# EasyEDA Pro project ProPrj_OPA4377运放改良.epro

# Schematic Schematic1
Create Date: 2023-03-22; Page Name: P1; Project Name: OPA4377运放2.0; Schematic Name: Schematic1; Update Date: 2023-03-23; Company: 嘉立创EDA; Page Size: A4; Version: V1.0
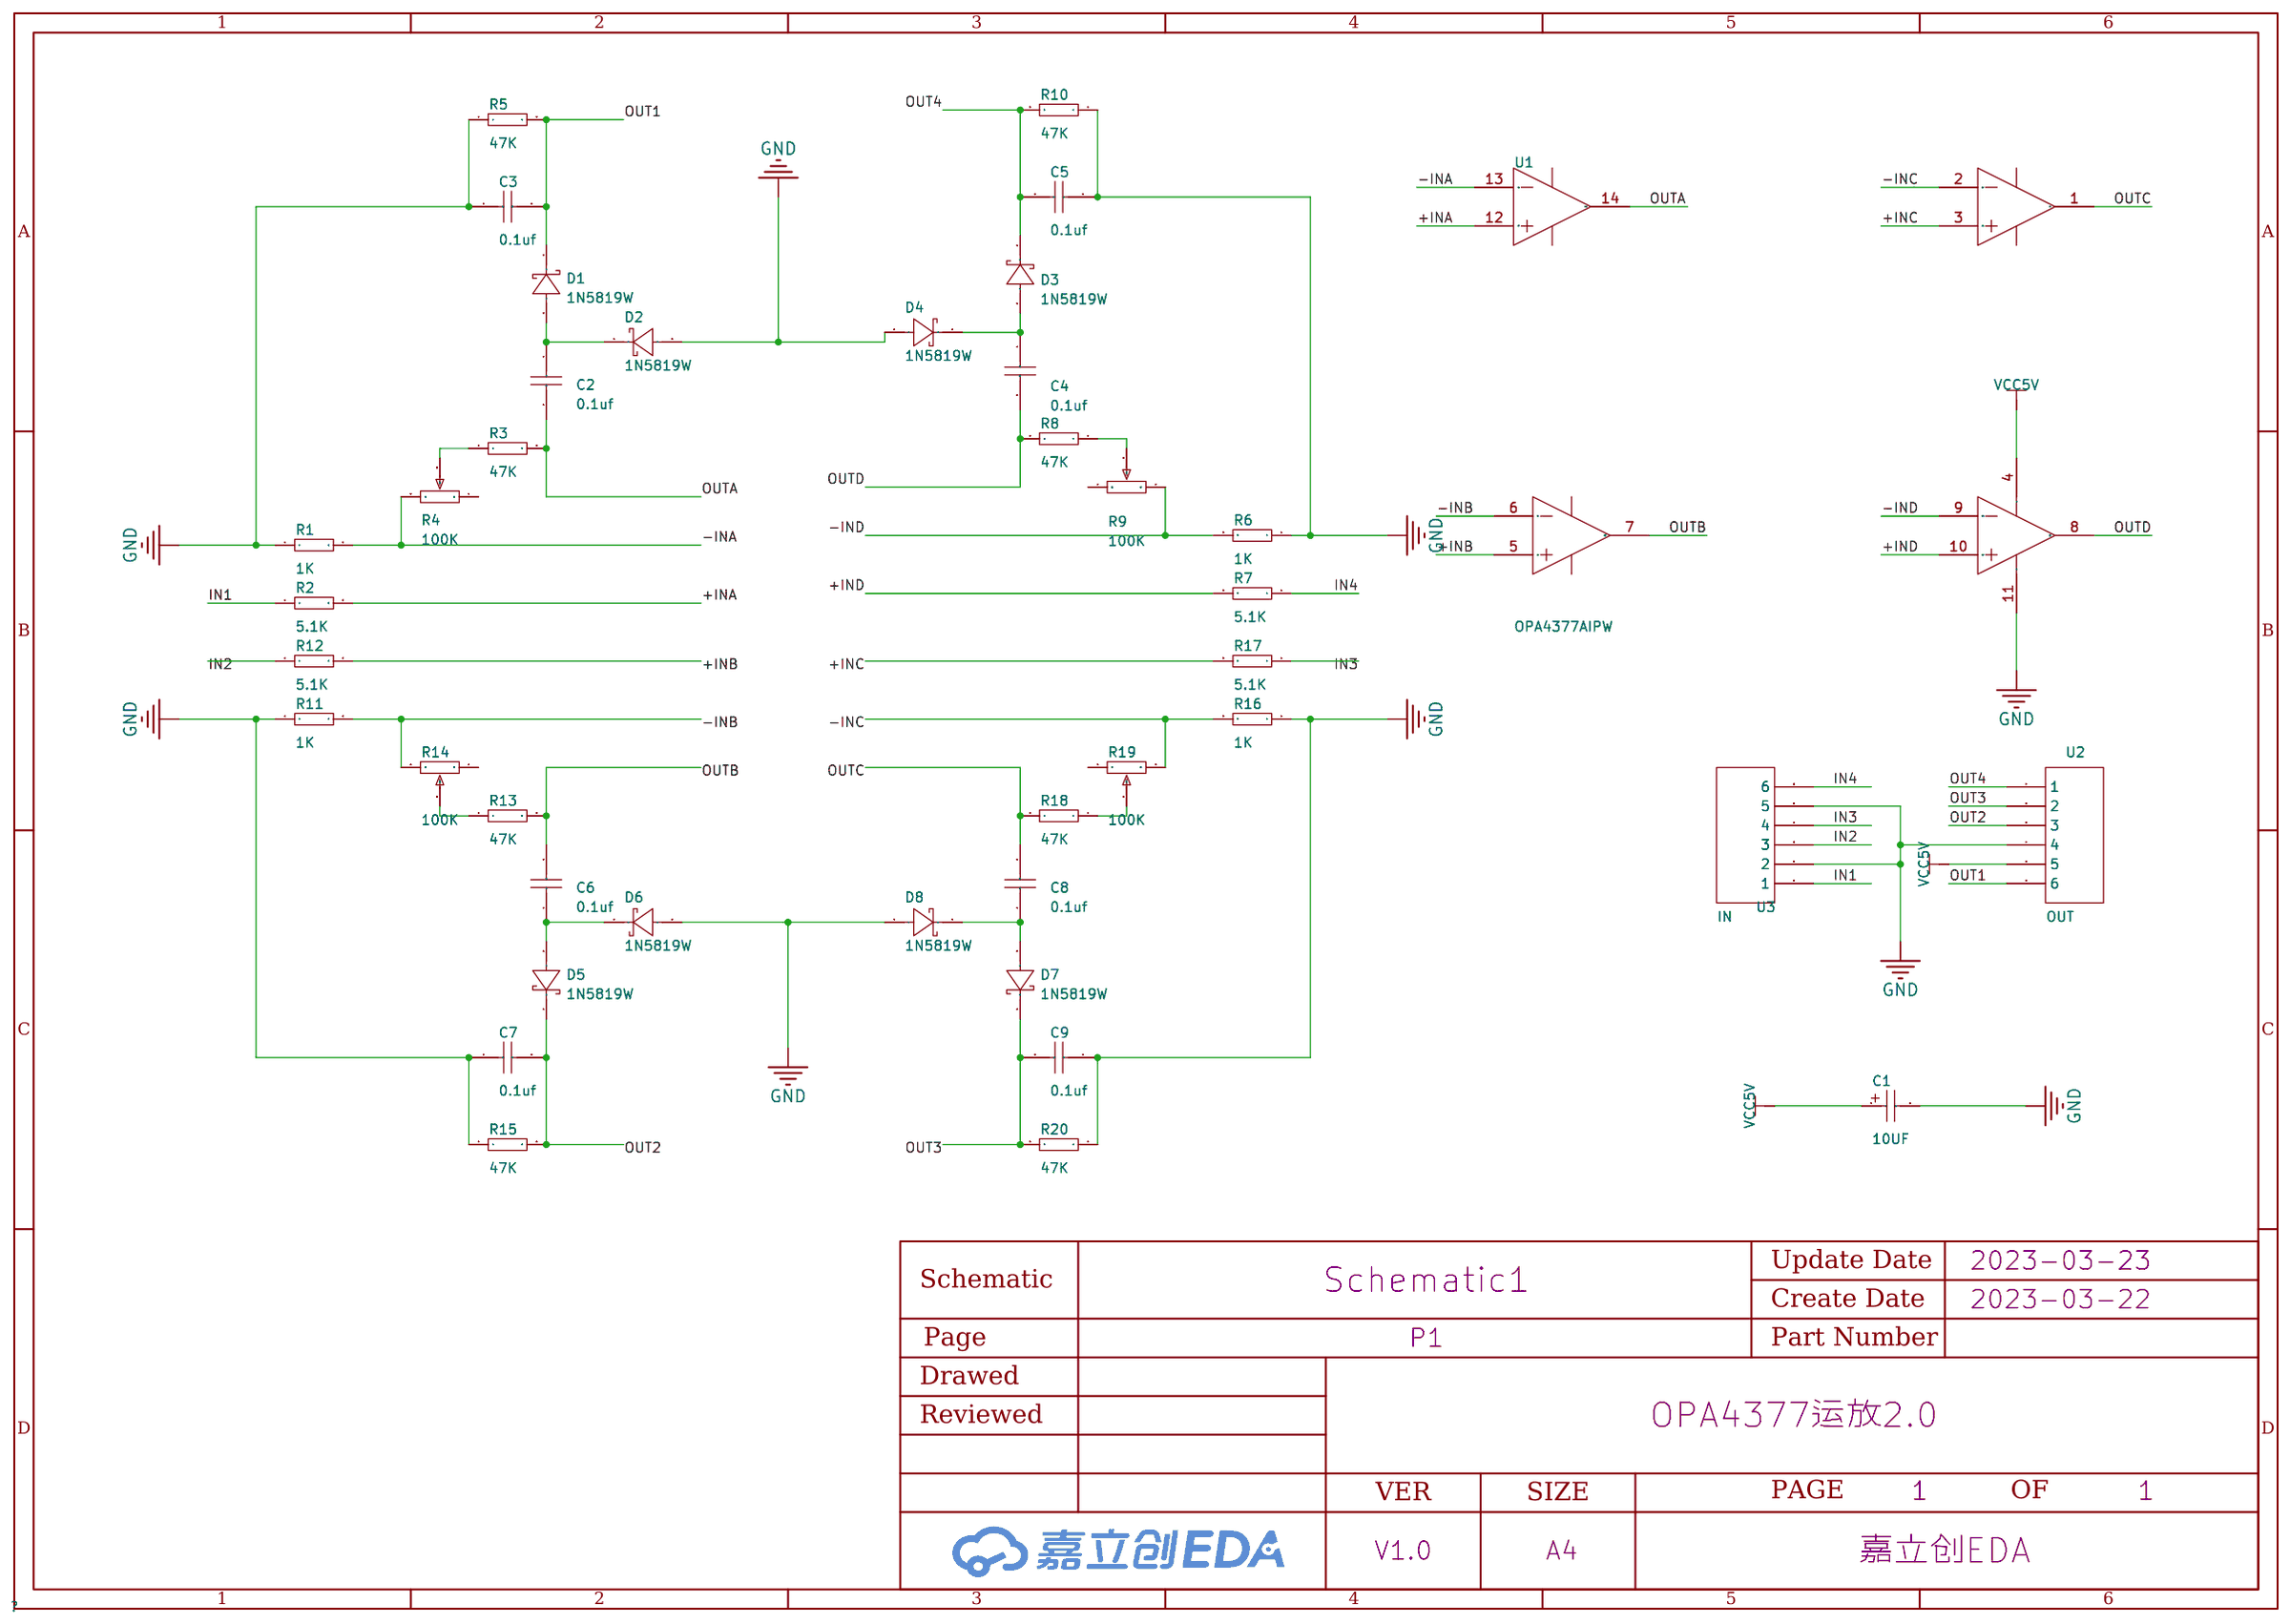
[diagram p0: schematic sheet]

## Parts
C1  10UF  [CASE-A_3216]
C2  1uF  [CAPC1608[0603]S-N]
C3  1uF  [CAPC1608[0603]S-N]
C4  1uF  [CAPC1608[0603]S-N]
C5  1uF  [CAPC1608[0603]S-N]
C6  1uF  [CAPC1608[0603]S-N]
C7  1uF  [CAPC1608[0603]S-N]
C8  1uF  [CAPC1608[0603]S-N]
C9  1uF  [CAPC1608[0603]S-N]
D1  1N5819W  [SOD-123_L2.7-W1.6-LS3.7-RD-1]
D2  1N5819W  [SOD-123_L2.7-W1.6-LS3.7-RD-1]
D3  1N5819W  [SOD-123_L2.7-W1.6-LS3.7-RD-1]
D4  1N5819W  [SOD-123_L2.7-W1.6-LS3.7-RD-1]
D5  1N5819W  [SOD-123_L2.7-W1.6-LS3.7-RD-1]
D6  1N5819W  [SOD-123_L2.7-W1.6-LS3.7-RD-1]
D7  1N5819W  [SOD-123_L2.7-W1.6-LS3.7-RD-1]
D8  1N5819W  [SOD-123_L2.7-W1.6-LS3.7-RD-1]
R1  10R  [RESC1608[0603]S-N]
R2  10R  [RESC1608[0603]S-N]
R3  10R  [RESC1608[0603]S-N]
R4  100K  [RESPOT3296]
R5  10R  [RESC1608[0603]S-N]
R6  10R  [RESC1608[0603]S-N]
R7  10R  [RESC1608[0603]S-N]
R8  10R  [RESC1608[0603]S-N]
R9  100K  [RESPOT3296]
R10  10R  [RESC1608[0603]S-N]
R11  10R  [RESC1608[0603]S-N]
R12  10R  [RESC1608[0603]S-N]
R13  10R  [RESC1608[0603]S-N]
R14  100K  [RESPOT3296]
R15  10R  [RESC1608[0603]S-N]
R16  10R  [RESC1608[0603]S-N]
R17  10R  [RESC1608[0603]S-N]
R18  10R  [RESC1608[0603]S-N]
R19  100K  [RESPOT3296]
R20  10R  [RESC1608[0603]S-N]
U1  OPA4377AIPW  [TSSOP-14_L5.0-W4.4-P0.65-LS6.4-BL]
U2  OUT  [HDR1X6]
U3  IN  [HDR1X6]

## Library data of the parts
C1 = TAJA105K035RNJ: 容值:1uF;精度:±10%;额定电压:35V;等效串联电阻:7.5Ω@100kHz;工作温度:-55℃~+125℃;; LCSC Part Name: 1uF±10%35V; Supplier Part: C7176; Manufacturer: KyoceraAVX; Supplier Footprint: CASE-A-3216; JLCPCB Part Class: ExtendedPart; Datasheet: https://atta.szlcsc.com/upload/public/pdf/source/20160107/1457707748301.pdf; Supplier: LCSC; Tolerance: ±10%; Rated Voltage: 35V; Equivalent Series Resistance(ESR): 7.5Ω@100kHz; Operating Temperature: -55℃~+125℃
C2-C9 = Cap-Chip_1: Published: 2020-12-18; Revision: V1.1; Voltage: 50V; Tolerance: ±10%; Origin Footprint 2: CAPC1310[0504]S; Origin Footprint 3: CAPC3216[1206]S; Origin Footprint 4: CAPC3225[1210]S; Origin Footprint 5: CAPC4532[1812]S; Origin Footprint 6: CAPC4564[1825]S; Origin Footprint 7: CAPC2012[0805]; Origin Footprint 8: CAPC3216[1206]; Origin Footprint 9: CAPC3225[1210]; Origin Footprint 10: CAPC4532[1812]; Origin Footprint 11: CAPC4564[1825]; Origin Footprint 12: CAPC1608[0603]-N; Origin Footprint 13: CAPC1608[0603]-L; Origin Footprint 14: CAPC1608[0603]-M; Origin Footprint 15: CAPC1608[0603]S-L; Origin Footprint 16: CAPC1608[0603]S-M; Origin Footprint 17: CAPC1005[0402]-L; Origin Footprint 18: CAPC1005[0402]-M; Origin Footprint 19: CAPC1005[0402]-N; Origin Footprint 20: CAPC1005[0402]S-L; Origin Footprint 21: CAPC1005[0402]S-M; Origin Footprint 22: CAPC1005[0402]S-N; Origin Footprint 23: CAPC2012[0805]S-L; Origin Footprint 24: CAPC2012[0805]S-M; Origin Footprint 25: CAPC2012[0805]S-N
D1-D8 = 1N5819W: 二极管配置:-;直流反向耐压(Vr):40V;平均整流电流(Io):1A;正向压降(Vf):900mV@3A;反向电流(Ir):1mA@40V;; LCSC Part Name: 40V1A900mV@3A; Supplier Part: C2905650; Manufacturer: TECHPUBLIC(台舟); Supplier Footprint: SOD-123; JLCPCB Part Class: ExtendedPart; Datasheet: https://atta.szlcsc.com/upload/public/pdf/source/20211020/7FEA34DA99E5285CBA3CC87767B82BE7.pdf; Supplier: LCSC; Reverse Voltage (Vr): 40V; Average Rectified Current (Io): 1A; Forward Voltage (Vf@If): 900mV@3A; Reverse Leakage Current (Ir): 1mA@40V
R1-R3 R5-R8 R10-R13 R15-R18 R20 = Res-Chip_9: Published: 8-Jun-2000; Revision: July-2002:Re-releasedforDXPPlatform.; Tolerance: ±1%; Origin Footprint 2: RESC3225[1210]S; Origin Footprint 3: RESC5025[2010]S; Origin Footprint 4: RESC6332[2512]S; Origin Footprint 5: RESC5025[2010]; Origin Footprint 6: RESC6332[2512]; Origin Footprint 7: RESC3225[1210]; Origin Footprint 8: RESC3216[1206]; Origin Footprint 9: RESC2012[0805]; Origin Footprint 10: RESC1608[0603]-M; Origin Footprint 11: RESC1608[0603]-L; Origin Footprint 12: RESC1608[0603]-N; Origin Footprint 13: RESC1608[0603]S-L; Origin Footprint 14: RESC1608[0603]S-M; Origin Footprint 15: RESC1005[0402]-L; Origin Footprint 16: RESC1005[0402]-N; Origin Footprint 17: RESC1005[0402]-M; Origin Footprint 18: RESC1005[0402]S-L; Origin Footprint 19: RESC1005[0402]S-M; Origin Footprint 20: RESC1005[0402]S-N; Origin Footprint 21: RESC2012[0805]S-L; Origin Footprint 22: RESC2012[0805]S-M; Origin Footprint 23: RESC2012[0805]S-N; Origin Footprint 24: RESC3216[1206]S-L; Origin Footprint 25: RESC3216[1206]S-M; Origin Footprint 26: RESC3216[1206]S-N
R4 R9 R14 R19 = Res Adj 3p: Origin Footprint 2: RESPOTSMALL
U1 = OPA4377AIPW: 四路低成本、低噪声、5.5MHz CMOS 运算放大器 14-TSSOP -40 to 125; Supplier Part: C1346362; Manufacturer: TI(德州仪器); Supplier Footprint: TSSOP-14; JLCPCB Part Class: ExtendedPart; Datasheet: https://atta.szlcsc.com/upload/public/pdf/source/20230221/EF1F22C2868CA7F32EC9D4A7EBFD265F.pdf; Supplier: LCSC
U2 U3 = Header 6: LatestRevisionDate: 17-Jul-2002; LatestRevisionNote: Re-releasedforDXPPlatform.; Publisher: AltiumLimited; Price(RMB): 0.00; Origin Footprint 2: PH2.0-6; Origin Footprint 3: XH2.54-6; Origin Footprint 4: VH3.96-6; Origin Footprint 5: GH1.25T-6P; Origin Footprint 6: ZH1.5-WF-6P

## Nets
GND: C1.2 C3.1 C5.1 C7.1 C9.1 D2.2(A) D4.2(A) D6.2(A) D8.2(A) R1.1 R5.1 R6.1 R10.1 R11.1 R15.1 R16.1 R20.1 U1.11(V-) U2.4 U3.2 U3.5
VCC5V: C1.1 U1.4(V+) U2.5
+INA: R2.2 U1.12(IN D+)
+INB: R12.2 U1.5(IN B+)
+INC: R17.2 U1.3(IN A+)
+IND: R7.2 U1.10(IN C+)
-INA: R1.2 R4.2(BOT) U1.13(IN D-)
-INB: R11.2 R14.2(BOT) U1.6(IN B-)
-INC: R16.2 R19.2(BOT) U1.2(IN A-)
-IND: R6.2 R9.2(BOT) U1.9(IN C-)
IN1: R2.1 U3.1
IN2: R12.1 U3.3
IN3: R17.1 U3.4
IN4: R7.1 U3.6
OUT1: C3.2 D1.1(K) R5.2 U2.6
OUT2: C7.2 D5.1(K) R15.2 U2.3
OUT3: C9.2 D7.1(K) R20.2 U2.2
OUT4: C5.2 D3.1(K) R10.2 U2.1
OUTA: C2.2 R3.2 U1.14(OUT D)
OUTB: C6.2 R13.2 U1.7(OUT B)
OUTC: C8.2 R18.2 U1.1(OUT A)
OUTD: C4.2 R8.2 U1.8(OUT C)
$1N1144: R3.1 R4.ADJ
$1N1300: C2.1 D1.2(A) D2.1(K)
$1N3786: R8.1 R9.ADJ
$1N3789: C4.1 D3.2(A) D4.1(K)
$1N4182: R13.1 R14.ADJ
$1N4185: C6.1 D5.2(A) D6.1(K)
$1N4578: R18.1 R19.ADJ
$1N4581: C8.1 D7.2(A) D8.1(K)

Not connected (* = marked no-connect by the designer): R4 1(TOP); R9 1(TOP); R14 1(TOP); R19 1(TOP)

# Board PCB1
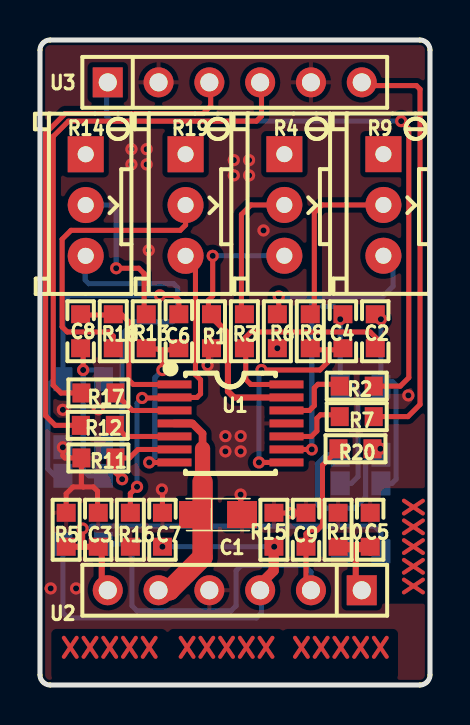
[diagram p1: board, top side]
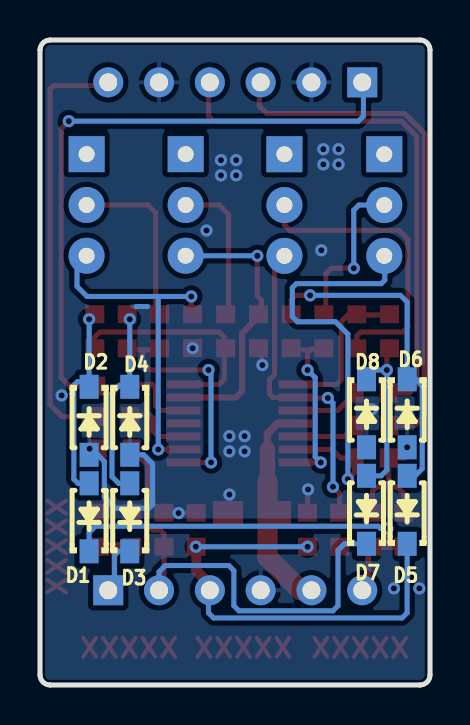
[diagram p2: board, bottom side, seen from below]

Outline 19.5 x 32.26 mm; copper layers: Top Layer, Bottom Layer. Coordinates in mm from the lower left corner of the outline.
Outline path: 0,31.75 0,0.51 arc(0.15,0.15) 0.51,0 18.99,0 arc(19.35,0.15) 19.5,0.51 19.5,31.75 arc(19.35,32.11) 18.99,32.26 0.51,32.26 arc(0.15,32.11) 0,31.75
Stack: Top Layer 0.035mm / Dielectric1 1.51mm FR4 er 4.5 / Bottom Layer 0.035mm

## Design rules (mm)
template: 自定义配置
spacing copperThickness1oz (default): track to track 0.102, other pairs 0.152 to 0.3
spacing copperThickness2oz: track to track 0.203, other pairs 0.152 to 0.3
track width copperThickness1oz (default): min 0.127, default 0.254, max 2.54
track width copperThickness2oz: min 0.203, default 0.254, max 2.54
differential pair differentialPair (default): width min 0.127, default 0.254, max 2.54; gap min 0.152, default 0.152
via viaSize (default): diameter min 0.5, default 0.61, max 10; hole min 0.3, default 0.305, max 6.3

## Placement (name value [footprint] x y rotation side)
C1  10UF  [CASE-A_3216]  8.9 8.52 0 top
C2  1uF  [CAPC1608[0603]S-N]  16.76 17.69 270 top
C3  1uF  [CAPC1608[0603]S-N]  2.91 7.76 270 top
C4  1uF  [CAPC1608[0603]S-N]  15.15 17.69 270 top
C5  1uF  [CAPC1608[0603]S-N]  16.51 7.76 270 top
C6  1uF  [CAPC1608[0603]S-N]  6.94 17.69 270 top
C7  1uF  [CAPC1608[0603]S-N]  6.12 7.76 270 top
C8  1uF  [CAPC1608[0603]S-N]  2.03 17.69 90 top
C9  1uF  [CAPC1608[0603]S-N]  13.3 7.76 270 top
D1  1N5819W  [SOD-123_L2.7-W1.6-LS3.7-RD-1]  17.04 8.39 90 bottom
D2  1N5819W  [SOD-123_L2.7-W1.6-LS3.7-RD-1]  17.04 13.21 270 bottom
D3  1N5819W  [SOD-123_L2.7-W1.6-LS3.7-RD-1]  15.01 8.39 90 bottom
D4  1N5819W  [SOD-123_L2.7-W1.6-LS3.7-RD-1]  15.01 13.21 270 bottom
D5  1N5819W  [SOD-123_L2.7-W1.6-LS3.7-RD-1]  1.14 8.76 90 bottom
D6  1N5819W  [SOD-123_L2.7-W1.6-LS3.7-RD-1]  1.14 13.59 270 bottom
D7  1N5819W  [SOD-123_L2.7-W1.6-LS3.7-RD-1]  3.17 8.76 90 bottom
D8  1N5819W  [SOD-123_L2.7-W1.6-LS3.7-RD-1]  3.17 13.59 270 bottom
R1  10R  [RESC1608[0603]S-N]  8.57 17.69 90 top
R2  10R  [RESC1608[0603]S-N]  15.84 14.95 180 top
R3  10R  [RESC1608[0603]S-N]  10.22 17.69 270 top
R4  100K  [RESPOT3296]  12.22 26.55 270 top
R5  10R  [RESC1608[0603]S-N]  1.31 7.76 270 top
R6  10R  [RESC1608[0603]S-N]  11.87 17.69 90 top
R7  10R  [RESC1608[0603]S-N]  15.84 13.42 180 top
R8  10R  [RESC1608[0603]S-N]  13.51 17.69 270 top
R9  100K  [RESPOT3296]  17.17 26.55 270 top
R10  10R  [RESC1608[0603]S-N]  14.9 7.76 270 top
R11  10R  [RESC1608[0603]S-N]  2.92 11.36 0 top
R12  10R  [RESC1608[0603]S-N]  2.89 12.99 0 top
R13  10R  [RESC1608[0603]S-N]  5.31 17.69 270 top
R14  100K  [RESPOT3296]  2.29 26.54 270 top
R15  10R  [RESC1608[0603]S-N]  11.7 7.76 270 top
R16  10R  [RESC1608[0603]S-N]  4.52 7.76 90 top
R17  10R  [RESC1608[0603]S-N]  2.92 14.6 0 top
R18  10R  [RESC1608[0603]S-N]  3.66 17.69 90 top
R19  100K  [RESPOT3296]  7.28 26.54 270 top
R20  10R  [RESC1608[0603]S-N]  15.77 11.82 180 top
U1  OPA4377AIPW  [TSSOP-14_L5.0-W4.4-P0.65-LS6.4-BL]  9.52 13.08 270 top
U2  OUT  [HDR1X6]  16.09 4.74 180 top
U3  IN  [HDR1X6]  3.39 30.14 0 top

## Footprints (pads in the part's own frame, mm; a bottom-side part is the same pattern mirrored in y, then rotated)
CAPC1608[0603]S-N
  rect 0.9x0.95 smd: 1(-0.85,0) 2(0.85,0)
CASE-A_3216
  rect 1.5x1.359 smd: 1(-1.2,0) 2(1.2,0)
HDR1X6
  rect 1.5x1.5 hole 0.9: 1(0,0)
  round 1.5 hole 0.9: 2(2.54,0) 3(5.08,0) 4(7.62,0) 5(10.16,0) 6(12.7,0)
RESC1608[0603]S-N
  rect 0.9x0.95 smd: 1(-0.85,0) 2(0.85,0)
RESPOT3296
  rect 1.8x1.8 hole 0.8: 1(0,0)
  round 1.8 hole 0.8: 2(5.08,0) ADJ(2.54,0)
SOD-123_L2.7-W1.6-LS3.7-RD-1
  rect 1.2x0.95 smd: 1(-1.7,0) 2(1.7,0)
TSSOP-14_L5.0-W4.4-P0.65-LS6.4-BL
  rect 0.4x1.7 smd: 1(-1.95,-2.8) 2(-1.3,-2.8) 3(-0.65,-2.8) 4(0,-2.8) 5(0.65,-2.8) 6(1.3,-2.8) 7(1.95,-2.8) 8(1.95,2.8) 9(1.3,2.8) 10(0.65,2.8) 11(0,2.8) 12(-0.65,2.8) 13(-1.3,2.8) 14(-1.95,2.8)

## Nets
As in the schematic.

Pads without a net: R4 1; R9 1; R14 1; R19 1

## Via types
v1: diameter 0.61, hole 0.305, Top Layer to Bottom Layer, 45 vias

## Routing (per net, layer and track width the routed paths; a pad name or vN(x,y) marks a point on that pad's centre or on a via; arc(x,y) is an arc through that point)
GND: length 20.8
  Top Layer w0.254: 2.88,8.61 2.88,9.7 2.67,9.91 2.16,9.91 ; C7.1 6.12,9.75 v1(6.1,9.78) ; R5.1 1.31,9.56 1.65,9.91 2.16,9.91 ; 13.3,8.6 v1(12.57,8.6) 11.68,8.6 ; 2.16,9.91 2.07,9.99 R11.1 1.25,11.36 1.14,11.46 v1(1.14,11.89) ; v1(8.38,16) 8.42,16.04 8.42,16.84 ; 10.03,8.43 v1(10.03,9.52)
  Bottom Layer w0.254: 14.12,18.93 14.69,18.93 ; D4.2 14.33,11.51 13.87,11.05 13.87,9.02 14.05,8.84 15.72,8.84 16.28,9.4 16.28,11.18 16.61,11.51 D2.2
  vias: v1(0.53,4.83) v1(1.14,13.76) v1(1.8,4.83) v1(2.92,13.79) v1(4.57,26.8) v1(4.57,26.03) v1(5.33,26.8) v1(5.33,26.03) v1(5.44,21.74) v1(9.27,12.45) v1(9.27,11.68) v1(9.69,26.25) v1(9.69,25.49) v1(10.03,12.45) v1(10.03,11.68) v1(10.45,26.25) v1(10.45,25.49) v1(11.18,22.73) v1(11.87,16.84) v1(17.02,11.82) v1(18.42,14.48)
VCC5V: length 10.7
  Top Layer w0.381: U1.4 7.62,13.08 8.13,12.57 8.13,11.81
  Top Layer w0.762: 8.13,11.81 8.13,10.16
  Top Layer w1.016: U2.5 6.47,4.74 8.13,6.39 8.13,10.16
+INA: length 3.8
  Top Layer w0.254: R2.2 14.89,15.04 13.9,15.04 13.72,14.86 13.72,13.97 13.48,13.73 U1.12
+INB: length 3.2
  Top Layer w0.254: 6.72,12.43 4.3,12.43 R12.2
+INC: length 3.3
  Top Layer w0.254: R17.2 3.77,14.58 4.62,13.73 U1.3
+IND: length 3.5
  Top Layer w0.254: R7.2 14.89,13.51 14.02,13.51 13.84,13.33 13.84,12.7 13.57,12.43 12.32,12.43
-INA: length 13.9
  Top Layer w0.254: 8.42,18.54 8.42,19.24 8.64,19.46 v1(8.64,21.46)
  Top Layer w0.305: 8.42,18.54 8.45,18.54 9.4,17.59 9.4,14.69 9.7,14.38 U1.13
  Bottom Layer w0.254: v1(8.64,21.46) 8.64,21.47 R4.2
-INB: length 22.2
  Top Layer w0.254: U1.6 4.9,11.78 4.47,11.36 R11.2 3.77,10.63 v1(4.11,10.29)
  Bottom Layer w0.254: R14.2 2.26,21.44 2.26,20.25 2.44,20.07 6.68,20.07 6.88,19.86 6.88,18.42 6.63,18.17 4.73,18.17 4.11,17.55 v1(4.11,10.29)
-INC: length 16.2
  Top Layer w0.254: v1(4.85,9.91) 4.52,9.58 R16.2 ; R19.2 7.77,20.97 7.77,15.52 8.03,15.27 8.03,14.56 7.85,14.38 U1.2 6.7,14.36 v1(5.11,14.36)
  Bottom Layer w0.254: v1(5.11,14.36) 4.85,14.1 v1(4.85,9.91)
-IND: length 17.6
  Top Layer w0.254: v1(11.94,19.43) 11.94,18.68 11.77,18.51 ; U1.9 v1(13.59,11.78)
  Bottom Layer w0.254: 13.59,19.43 v1(11.94,19.43) ; 13.59,19.43 17.14,19.43 17.65,19.94 17.65,20.99 R9.2 ; 13.59,19.43 v1(13.59,11.78)
IN1: length 31.5
  Top Layer w0.254: R2.1 18.02,14.95 18.44,15.37 18.44,27.82 v1(18.06,28.2)
  Bottom Layer w0.254: v1(18.06,28.2) 3.58,28.2 3.33,28.45 3.33,30.08 U3.1
IN2: length 26.2
  Top Layer w0.254: U3.3 8.54,30.07 8.54,28.96 8.15,28.58 1.27,28.58 0.28,27.59 0.28,13.47 0.76,12.99 R12.1 2.07,13.02 2.07,13.04
IN3: length 26.6
  Top Layer w0.254: R17.1 1.05,14.6 0.66,14.99 0.66,27.44 1.42,28.2 10.82,28.2 11.08,28.45 11.08,30.07 U3.4
IN4: length 21.4
  Top Layer w0.254: U3.6 16.25,29.98 18.82,29.98 19,29.8 19,14.03 18.4,13.42 R7.1
OUT1: length 20.8
  Top Layer w0.254: 2.16,6.91 2.13,6.94 v1(2.13,7.82)
  Top Layer w0.305: 2.88,6.91 R5.2 ; 2.88,6.91 3.09,6.7 3.09,4.74
  Bottom Layer w0.254: D1.1 17.04,7.62 16.73,7.94 2.58,7.94 2.47,7.82 v1(2.13,7.82)
OUT2: length 22.9
  Top Layer w0.508: 11.68,6.9 11.68,5.71 10.71,4.74
  Bottom Layer w0.254: v1(6.12,6.91) v1(11.71,6.91) ; D5.1 1.14,3.61 1.4,3.35 10.82,3.35 11.08,3.61 11.08,4.67 U2.3
OUT3: length 24.4
  Top Layer w0.254: 13.25,4.74 13.3,4.79 C9.2 13.3,7.56 13.49,7.75 13.87,7.75 14.12,8.01 14.12,10.99 14.66,11.53 14.66,11.55 R20.2
  Bottom Layer w0.254: D7.1 4.27,7.06 4.6,6.74 4.6,3.96 4.85,3.71 9.55,3.71 9.81,3.96 9.81,5.72 10.06,5.97 13.23,5.97 13.55,5.66 U2.2
OUT4: length 6.7
  Top Layer w0.305: 16.51,6.9 16.51,6.6 ; 15.81,6.9 15.79,6.88 15.79,4.74
  Top Layer w0.508: 14.95,6.9 16.51,6.9
  Bottom Layer w0.254: D3.1 15.57,6.69 15.77,6.48 15.77,5.05 U2.1
OUTA: length 11.7
  Top Layer w0.254: 16.76,16.8 16.89,16.8 16.89,17.27 16.51,17.65 10.54,17.65 10.29,17.4 10.29,15.28 10.54,15.03 12.32,15.03
OUTB: length 8.9
  Top Layer w0.254: 6.72,11.13 v1(5.46,11.13) ; v1(6.12,15.75) 6.12,16.61 5.97,16.76 ; 5.97,16.76 5.93,16.8 5.21,16.8 ; 5.97,16.76 6.82,16.76 6.86,16.8
  Bottom Layer w0.254: v1(6.12,15.75) 5.74,15.37 5.74,11.41 v1(5.46,11.13)
OUTC: length 7.9
  Top Layer w0.254: 6.72,15.03 4.66,15.03 4.44,15.25 4.44,18.16 4.06,18.54 3.59,18.54 3.56,18.5 2.03,18.5
OUTD: length 11.9
  Top Layer w0.254: 14.25,16.76 14.38,16.64 14.38,16.13 14,15.75 v1(11.08,15.75) ; 14.25,16.76 15.07,16.76 15.11,16.8 ; 14.25,16.76 13.5,16.76 13.46,16.8 ; 12.32,11.13 v1(10.95,11.13)
  Bottom Layer w0.254: v1(10.95,11.13) 10.95,15.63 v1(11.08,15.75)
$1N1144: length 7.3
  Top Layer w0.254: R4.ADJ 10.55,24.01 10.07,23.53 10.07,18.54
$1N1300: length 9.9
  Bottom Layer w0.254: v1(17.04,18.29) D2.1 17.3,15.17 17.63,15.17 17.81,14.99 17.81,10.29 17.6,10.09 D1.2
$1N3786: length 8.8
  Top Layer w0.254: 13.46,18.5 13.72,18.76 13.72,23.62 14.1,24.01 R9.ADJ
$1N3789: length 10
  Top Layer w0.254: v1(15.01,18.29) 15.15,18.43 C4.1
  Bottom Layer w0.254: v1(15.01,18.29) D4.1 15.09,14.99 15.52,14.99 15.9,14.61 15.9,10.42 15.57,10.09 D3.2
$1N4182: length 8.1
  Top Layer w0.254: v1(3.81,20.84) 4.94,20.84 5.21,20.57 5.21,18.65 R13.1
  Bottom Layer w0.254: v1(3.81,20.84) 3.81,23.75 3.56,24 2.29,24
$1N4185: length 16.5
  Top Layer w0.254: v1(6,19.49) 6.71,19.49 6.94,19.25 C6.1
  Bottom Layer w0.254: v1(6,19.49) 1.47,19.49 1.14,19.16 1.14,15.29 0.71,15.29 0.39,14.97 0.39,10.82 0.74,10.46 D5.2
$1N4578: length 15.2
  Top Layer w0.254: 7.28,24 7.28,23.01 7.01,22.74 1.55,22.74 1.11,22.29 1.11,17.91 1.36,17.66 3.46,17.66 3.66,17.45 R18.1 ; 3.59,16.84 3.59,16.87
$1N4581: length 8.8
  Top Layer w0.254: v1(2.16,15.75) 2.16,16.72 C8.1
  Bottom Layer w0.254: D7.2 2.45,10.46 2.16,10.75 v1(2.16,15.75) 3.17,15.75 3.17,15.29

## Copper pours and planes (outline as drawn; the poured copper is in the pictures)
GND on Top Layer: -3.66,33.53 24.03,33.53 24.03,0.26 -3.66,0.26
GND on Bottom Layer: -6.07,34.8 23.27,34.8 23.27,-2.03 -6.07,-2.03

## Text on the board
Top Layer: xxxxx
